# EAGLE design Limit_switch_test_circuit (EAGLE 9.6.2)
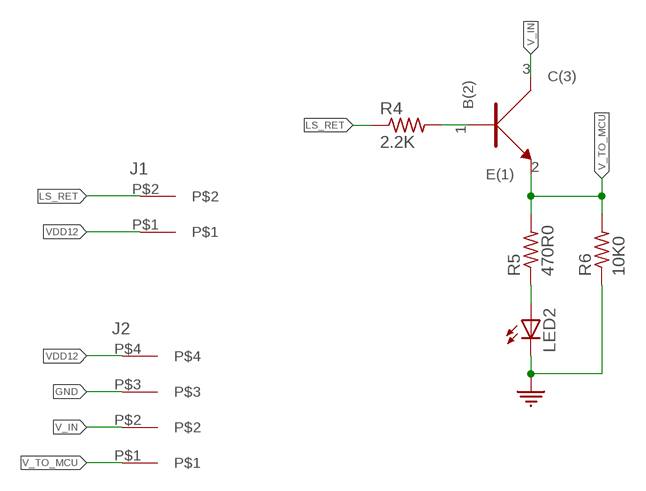
[diagram p0: schematic, sheet 1]

## Parts
J1  2-pos  3.81MM_1_X_2_RT_ANGLE_PLUG_HEADER  [2_3.81MM_PITCH]
J2  4-pos  3.81MM_1_X_4_RT_ANGLE_PLUG_HEADER  [1X4_3.81MM_PITCH]
LED2  Green  LED_0805_GREEN  [0805]
R4  2.2K  R_0402  [0402]
R5  470R0  R_0402_470R0  [0402]
R6  10K0  R_0402_10K0  [0402]
U2  NPN  BC846BW  [SOT323]

## Nets
GND: J2.P$3 LED2.2(C) R6.P$1
LS_RET: J1.P$2 R4.P$1
N$3: R4.P$2 U2.1(B(2))
N$4: LED2.1(A) R5.P$1
V_IN: J2.P$2 U2.3(C(3))
V_TO_MCU: J2.P$1 R5.P$2 R6.P$2 U2.2(E(1))
VDD12: J1.P$1 J2.P$4

## Library data of the parts
J1 = 3D_MIG_Controller:3.81MM_1_X_2_RT_ANGLE_PLUG_HEADER: TERM BLOCK HDR 2POS 90DEG 3.81MM; PARTNO: 691322310002
J2 = 3D_MIG_Controller:3.81MM_1_X_4_RT_ANGLE_PLUG_HEADER: 4 Position Terminal Block Header, Male Pins, Shrouded (4 Side) 0.150" (3.81mm) 90°, Right Angle - Through Hole; PARTNO: 691322310004
LED2 = 3D_MIG_Controller:LED_0805_GREEN: Green 570nm LED Indication - Discrete 2.2V 0805 (2012 Metric); PARTNO: LG R971-KN-1
R4 = 3D_MIG_Controller:R_0402
R5 = 3D_MIG_Controller:R_0402_470R0; PARTNO: RMCF0402JT470R
R6 = 3D_MIG_Controller:R_0402_10K0; PARTNO: RMCF0402JT10K0
U2 = 3D_MIG_Controller:BC846BW: Bipolar (BJT) Transistor NPN 100MHz Surface Mount SOT-323; PARTNO: BC846BW_NPN

## Board
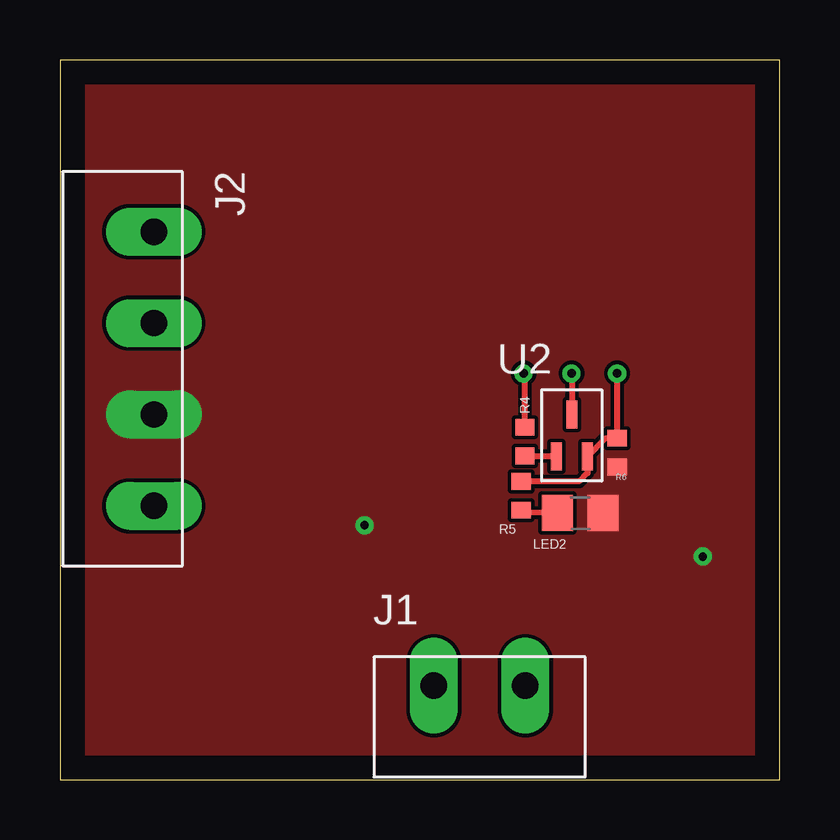
[diagram p1: board, top side]
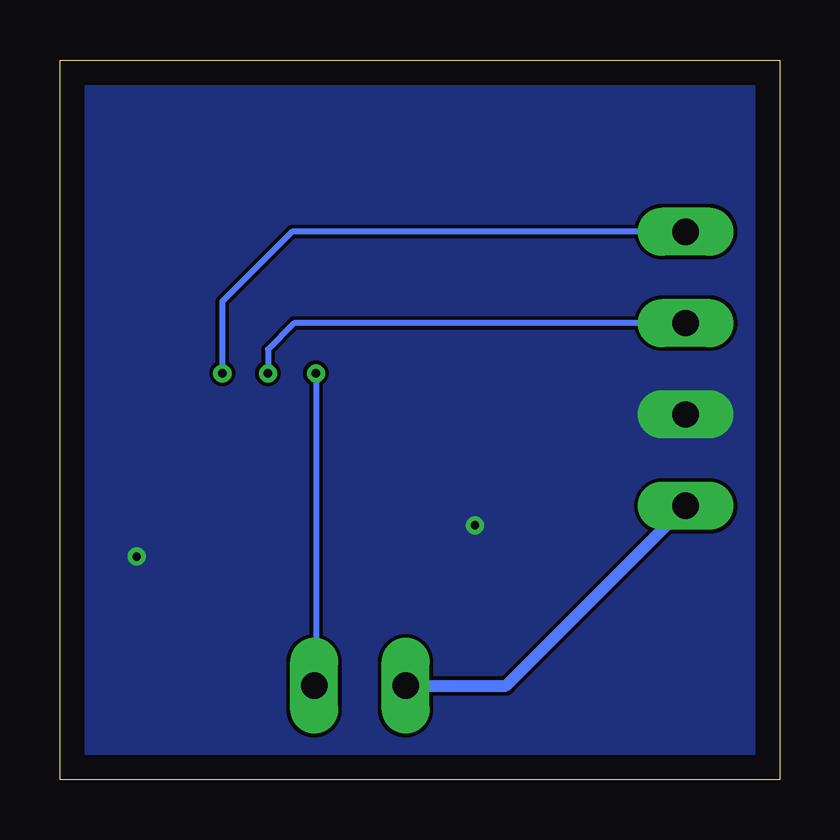
[diagram p2: board, bottom side, seen from below]

Size 30 x 30 mm. Coordinates in mm from the lower left corner, seen from the top.
Outline: 0,0 30,0 30,30 0,30 0,0
Copper layers (1*16): Top 0.035mm / dielectric 1.5mm / Bottom 0.035mm
Design rules "default": minimum track width 6mil, minimum drill 0.35mm, track to track 6mil, track to pad 6mil, pad to pad 6mil, via to via 6mil, smd to smd 6mil, copper to edge 40mil, drill to drill 6mil, minimum pad ring 10mil, minimum via ring 8mil, stop-mask expansion 4mil, vias tented up to drill 0mil, thermal gap 10mil

### Footprints (pad centres in the part's own frame; a part is rotated, then mirrored left to right if it is on the bottom)
2_3.81MM_PITCH = drill 1.1 pad 2 long: P$1 0,0; P$2 3.81,0
1X4_3.81MM_PITCH = drill 1.1 pad 2 long: P$1 0,0; P$2 3.81,0; P$3 7.62,0; P$4 11.43,0
0805 = smd 1.3 x 1.5: 1 -0.95,0; 2 0.95,0
0402 = smd 0.8 x 0.7: P$1 0,0.6; P$2 0,-0.6
SOT323 = smd 0.457 x 1.168: 1 -0.65,-0.876; 2 0.65,-0.876; 3 0,0.876

### Placement (x,y rotation side)
J1  15.59,3.91 0 top
J2  3.91,22.84 270 top
LED2  21.69,11.11 0 top
R4  19.38,14.09 0 top
R5  19.23,11.83 180 top
R6  23.23,13.63 180 top
U2  21.34,14.35 0 top

### Tracks (layer width: path | path; a pad name or v marks a point on that pad's centre or on a via)
GND  (via drill 0.35)
  other vias: 12.7,10.6 26.8,9.3
  pour Bottom (no thermals): 0,30.1 30,30.1 30,0 0,0
  pour Top (no thermals): 0,30.1 30,30.1 30,0 0,0
LS_RET  (via drill 0.35)
  Top 0.254: R4.P$1 19.38,16.88 v19.33,16.93
  Bottom 0.254: v19.33,16.93 19.33,3.98 J1.P$2
N$3
  Top 0.254: R4.P$2 U2.1
N$4
  Top 0.254: R5.P$1 19.33,11.13 20.73,11.12 LED2.1
V_IN  (via drill 0.35)
  Top 0.254: v21.33,16.93 v21.34,16.92 U2.3
  Bottom 0.254: J2.P$2 20.23,19.03 21.33,17.93 v21.33,16.93
V_TO_MCU  (via drill 0.35)
  Top 0.152: 23.33,14.33 R6.P$2
  Top 0.254: R5.P$2 21.65,12.43 21.99,12.77 U2.2 22.75,14.23 R6.P$2 v23.23,16.93
  Bottom 0.254: J2.P$1 20.32,22.84 23.23,19.93 v23.23,16.93
VDD12
  Bottom 0.508: J1.P$1 11.41,3.91 J2.P$4